# EAGLE design lcd_backpack_v2 (EAGLE 5.10)
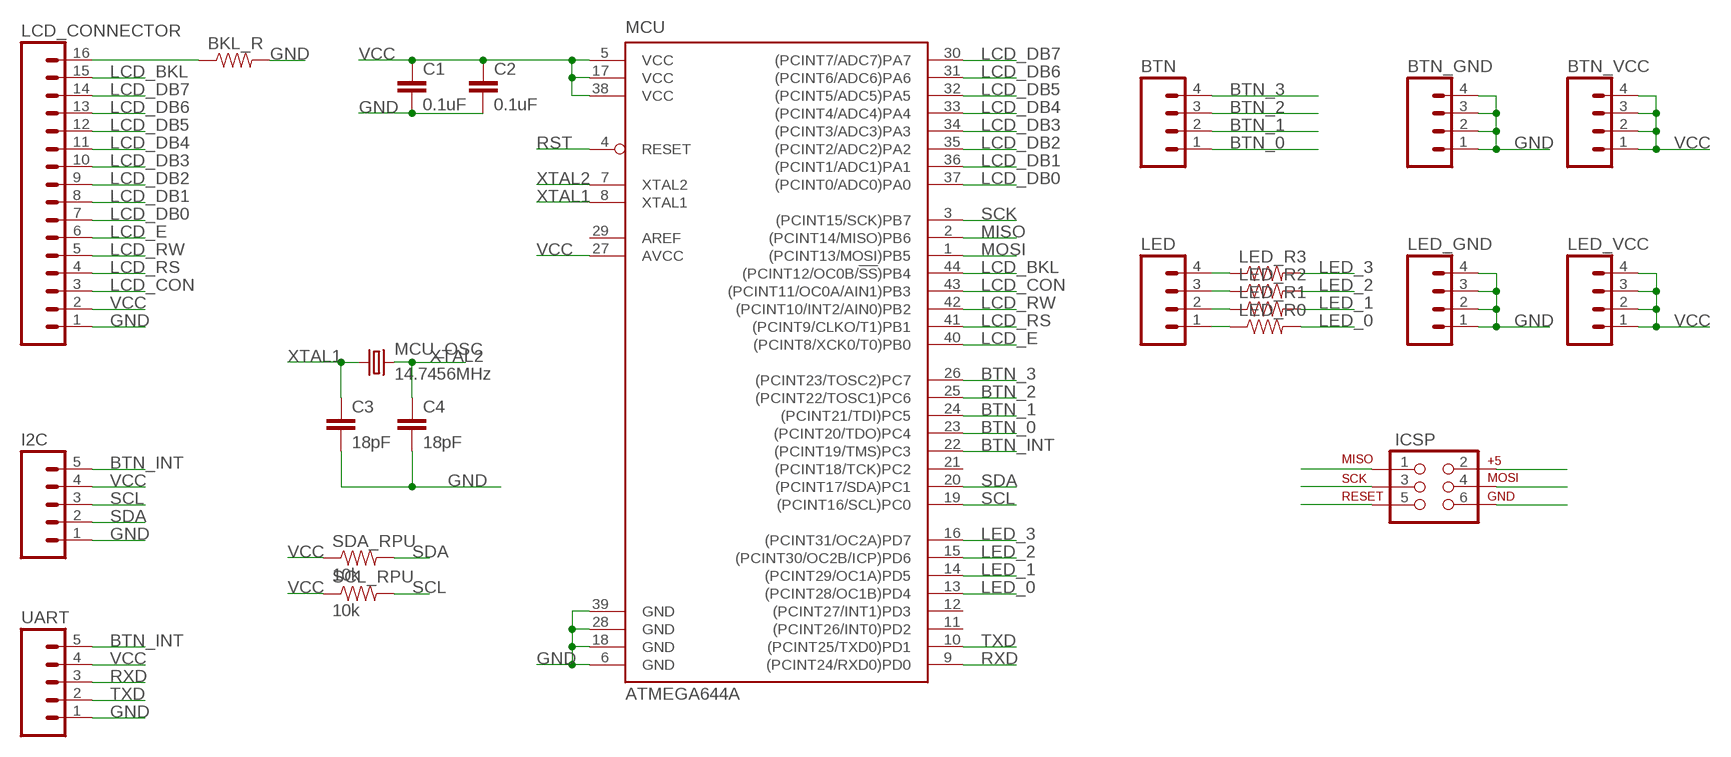
[diagram p0: schematic, sheet 1]

## Parts
BKL_R  RESISTOR0603-RES  [0603-RES]
BTN  M04PTH  [1X04]
BTN_GND  M04PTH  [1X04]
BTN_VCC  M04PTH  [1X04]
C1  0.1uF  CAP0603-CAP  [0603-CAP]
C2  0.1uF  CAP0603-CAP  [0603-CAP]
C3  18pF  CAP0603-CAP  [0603-CAP]
C4  18pF  CAP0603-CAP  [0603-CAP]
I2C  M05PTH  [1X05]
ICSP  AVR_SPI_PRG_6PTH  [2X3]
LCD_CONNECTOR  M16LONGPADS  [1X16_LONGPADS]
LED  M04PTH  [1X04]
LED_GND  M04PTH  [1X04]
LED_R0  RESISTOR0603-RES  [0603-RES]
LED_R1  RESISTOR0603-RES  [0603-RES]
LED_R2  RESISTOR0603-RES  [0603-RES]
LED_R3  RESISTOR0603-RES  [0603-RES]
LED_VCC  M04PTH  [1X04]
MCU  ATMEGA644A  [TQFP44]
MCU_OSC  14.7456MHz  CRYSTAL5X3  [CRYSTAL-SMD-5X3]
SCL_RPU  10k  RESISTOR0603-RES  [0603-RES]
SDA_RPU  10k  RESISTOR0603-RES  [0603-RES]
UART  M05PTH  [1X05]

## Nets
BTN_0: BTN.1 MCU.23((PCINT20/TDO)PC4)
BTN_1: BTN.2 MCU.24((PCINT21/TDI)PC5)
BTN_2: BTN.3 MCU.25((PCINT22/TOSC1)PC6)
BTN_3: BTN.4 MCU.26((PCINT23/TOSC2)PC7)
BTN_INT: I2C.5 MCU.22((PCINT19/TMS)PC3) UART.5
GND [supply]: BKL_R.2 BTN_GND.1 BTN_GND.2 BTN_GND.3 BTN_GND.4 C1.2 C2.2 C3.2 C4.2 I2C.1 ICSP.6 LCD_CONNECTOR.1 LED_GND.1 LED_GND.2 LED_GND.3 LED_GND.4 MCU.6(GND) MCU.18(GND) MCU.28(GND) MCU.39(GND) UART.1
LCD_BKL: LCD_CONNECTOR.15 MCU.44((PCINT12/OC0B/!SS!)PB4)
LCD_CON: LCD_CONNECTOR.3 MCU.43((PCINT11/OC0A/AIN1)PB3)
LCD_DB0: LCD_CONNECTOR.7 MCU.37((PCINT0/ADC0)PA0)
LCD_DB1: LCD_CONNECTOR.8 MCU.36((PCINT1/ADC1)PA1)
LCD_DB2: LCD_CONNECTOR.9 MCU.35((PCINT2/ADC2)PA2)
LCD_DB3: LCD_CONNECTOR.10 MCU.34((PCINT3/ADC3)PA3)
LCD_DB4: LCD_CONNECTOR.11 MCU.33((PCINT4/ADC4)PA4)
LCD_DB5: LCD_CONNECTOR.12 MCU.32((PCINT5/ADC5)PA5)
LCD_DB6: LCD_CONNECTOR.13 MCU.31((PCINT6/ADC6)PA6)
LCD_DB7: LCD_CONNECTOR.14 MCU.30((PCINT7/ADC7)PA7)
LCD_E: LCD_CONNECTOR.6 MCU.40((PCINT8/XCK0/T0)PB0)
LCD_RS: LCD_CONNECTOR.4 MCU.41((PCINT9/CLKO/T1)PB1)
LCD_RW: LCD_CONNECTOR.5 MCU.42((PCINT10/INT2/AIN0)PB2)
LED_0: LED_R0.2 MCU.13((PCINT28/OC1B)PD4)
LED_1: LED_R1.2 MCU.14((PCINT29/OC1A)PD5)
LED_2: LED_R2.2 MCU.15((PCINT30/OC2B/ICP)PD6)
LED_3: LED_R3.2 MCU.16((PCINT31/OC2A)PD7)
MISO: ICSP.1 MCU.2((PCINT14/MISO)PB6)
MOSI: ICSP.4 MCU.1((PCINT13/MOSI)PB5)
N$1: LED.1 LED_R0.1
N$2: LED.2 LED_R1.1
N$3: LED.3 LED_R2.1
N$4: LED.4 LED_R3.1
N$9: BKL_R.1 LCD_CONNECTOR.16
RST: ICSP.5 MCU.4(RESET)
RXD: MCU.9((PCINT24/RXD0)PD0) UART.3
SCK: ICSP.3 MCU.3((PCINT15/SCK)PB7)
SCL: I2C.3 MCU.19((PCINT16/SCL)PC0) SCL_RPU.2
SDA: I2C.2 MCU.20((PCINT17/SDA)PC1) SDA_RPU.2
TXD: MCU.10((PCINT25/TXD0)PD1) UART.2
VCC [supply]: BTN_VCC.1 BTN_VCC.2 BTN_VCC.3 BTN_VCC.4 C1.1 C2.1 I2C.4 ICSP.2 LCD_CONNECTOR.2 LED_VCC.1 LED_VCC.2 LED_VCC.3 LED_VCC.4 MCU.5(VCC) MCU.17(VCC) MCU.27(AVCC) MCU.38(VCC) SCL_RPU.1 SDA_RPU.1 UART.4
XTAL1: C3.1 MCU.8(XTAL1) MCU_OSC.1
XTAL2: C4.1 MCU.7(XTAL2) MCU_OSC.3
Unconnected: MCU.11((PCINT26/INT0)PD2) MCU.12((PCINT27/INT1)PD3) MCU.21((PCINT18/TCK)PC2) MCU.29(AREF)

## Library data of the parts
BKL_R LED_R0 LED_R1-LED_R3 SCL_RPU SDA_RPU = SparkFun:RESISTOR: Resistor Basic schematic elements and footprints for 0603, 1206, and PTH 1/10th watt (small) resistors.
BTN BTN_GND BTN_VCC LED LED_GND LED_VCC = SparkFun:M04: Header 4 Standard 4-pin 0.1" header. Use with straight break away headers (SKU : PRT-00116), right angle break away headers (PRT-00553), swiss pins (PRT-00743), machine pins (PRT-00117), and female headers (PRT-00115). Molex polarized connector foot print use with SKU : PRT-08231 with associated crimp pins and housings.
C1-C4 = SparkFun:CAP: Capacitor Standard 0603 ceramic capacitor, and 0.1" leaded capacitor.
I2C UART = SparkFun:M05: Header 5 Standard 5-pin 0.1" header. Use with straight break away headers (SKU : PRT-00116), right angle break away headers (PRT-00553), swiss pins (PRT-00743), machine pins (PRT-00117), and female headers (PRT-00115). Molex polarized connector foot print use with SKU : PRT-08230 with associated crimp pins and housings.
ICSP = SparkFun:AVR_SPI_PRG_6: AVR ISP 6 Pin This is the reduced ISP connector for AVR programming. Common on Arduino. This footprint will take up less PCB space and can be used with a 10-pin to 6-pin adapter such as SKU: BOB-08508
LCD_CONNECTOR = SparkFun:M16
MCU = atmel:ATMEGA644: 8-bit Microcontroller with 64K Bytes In-System Programmable Flash Source: http://www.atmel.com/dyn/resources/prod_documents/doc2593.pdf
MCU_OSC = SparkFun:CRYSTAL: Crystals Various standard crystals. Proven footprints. Spark Fun Electronics SKU : COM-00534

## Net classes
0 signal: width 0.152 mm
1 supply: width 0.305 mm

## Board
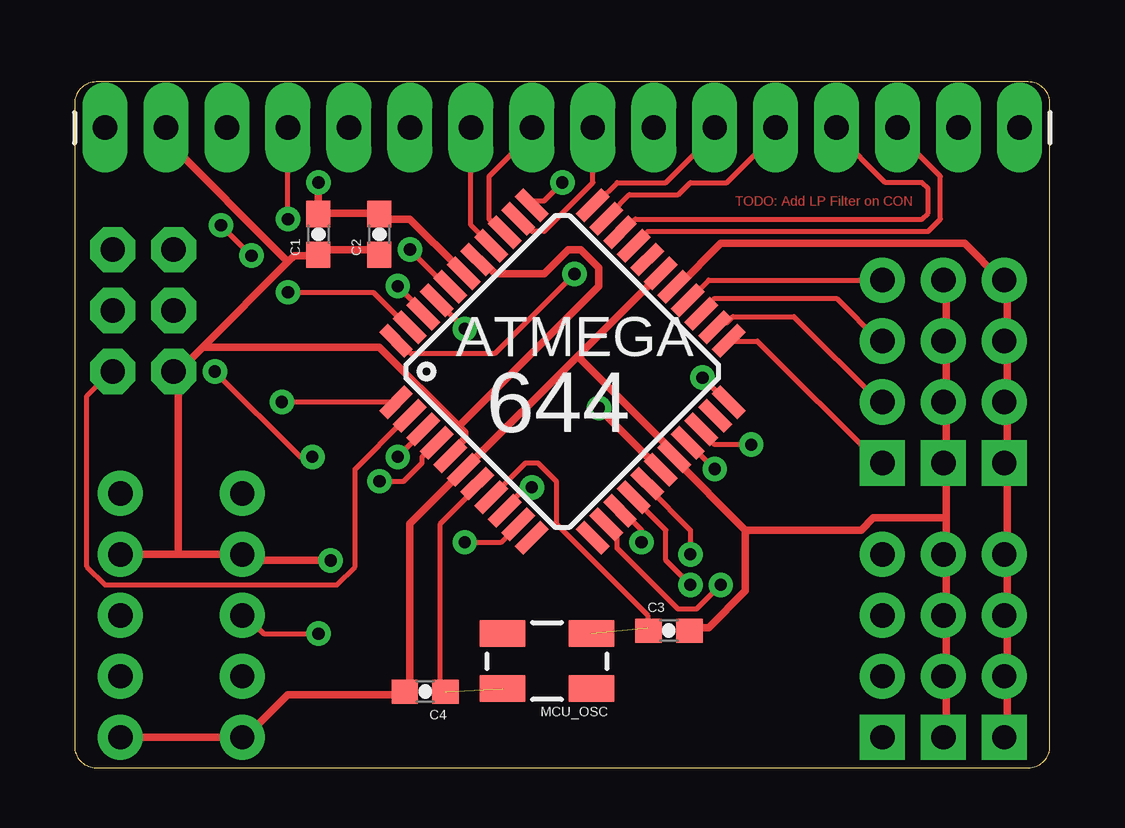
[diagram p1: board, top side]
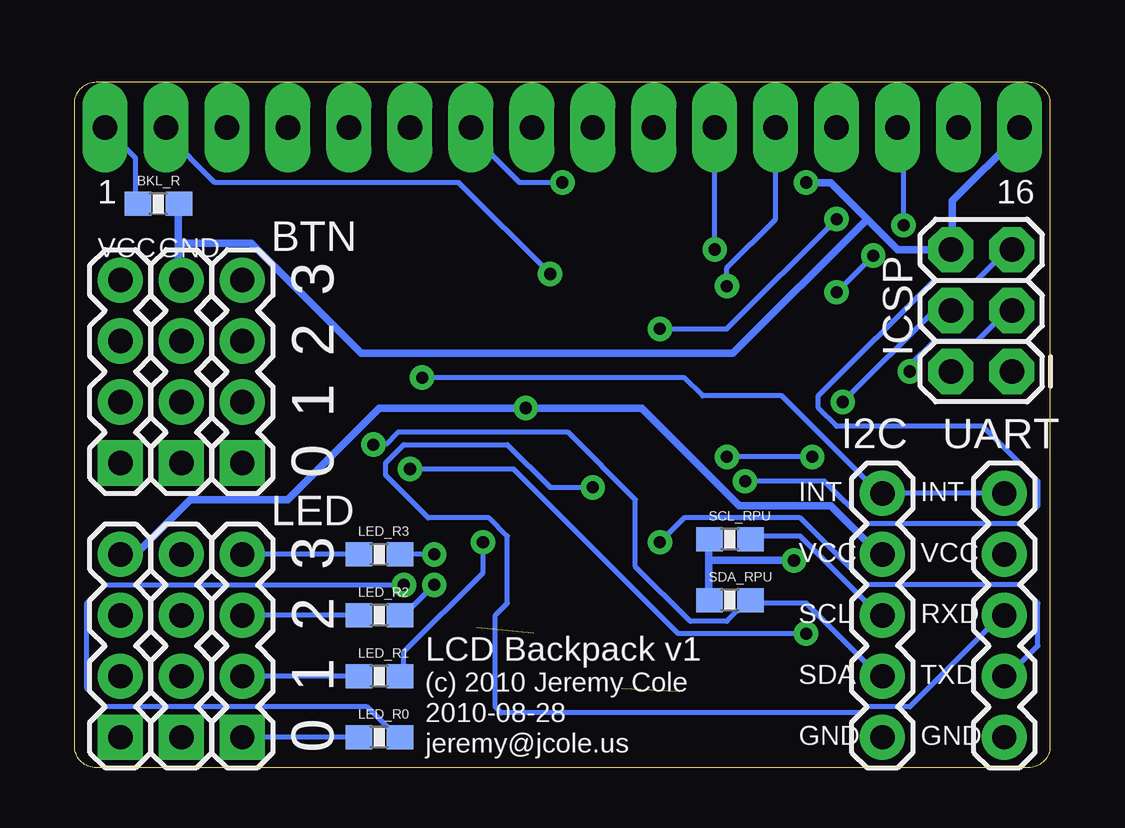
[diagram p2: board, bottom side, seen from below]

Size 40.64 x 28.57 mm. Coordinates in mm from the lower left corner, seen from the top.
Outline: 39.74,0 arc90 40.64,0.9 40.64,27.68 arc90 39.74,28.57 0.9,28.57 arc90 0,27.68 0,0.9 arc90 0.9,0 39.74,0
Copper layers (1*16): Top 0.035mm / dielectric 1.5mm / Bottom 0.035mm
Design rules "SparkFun": minimum track width 8mil, minimum drill 20mil, track to track 8mil, track to pad 8mil, pad to pad 8mil, via to via 8mil, smd to smd 8mil, copper to edge 10mil, drill to drill 8mil, minimum pad ring 12mil, minimum via ring 10mil, stop-mask expansion 4mil, vias tented up to drill 25mil, thermal gap 10mil
tRestrict: area 16.5,2.5 to 22.9,6.3
bRestrict: area 16.5,2.5 to 22.9,6.3

### Footprints (pad centres in the part's own frame; a part is rotated, then mirrored left to right if it is on the bottom)
0603-RES = smd 1.1 x 1: 1 -0.85,0; 2 0.85,0
1X04 = drill 1.016 pad 1.88 square: 1 0,0 | drill 1.016 pad 1.88 round: 2 2.54,0; 3 5.08,0; 4 7.62,0
0603-CAP = smd 1.1 x 1: 1 -0.85,0; 2 0.85,0
1X05 = drill 1.016 pad 1.88 round: 1 0,0; 2 2.54,0; 3 5.08,0; 4 7.62,0; 5 10.16,0
2X3 = drill 1.016 pad 1.88 octagon: 1 0,0; 2 0,2.54; 3 2.54,0; 4 2.54,2.54; 5 5.08,0; 6 5.08,2.54
1X16_LONGPADS = drill 1.016 pad 1.88 long: 1 0,0; 2 2.54,0; 3 5.08,0; 4 7.62,0; 5 10.16,0; 6 12.7,0; 7 15.24,0; 8 17.78,0; 9 20.32,0; 10 22.86,0; 11 25.4,0; 12 27.94,0; 13 30.48,0; 14 33.02,0; 15 35.56,0; 16 38.1,0
TQFP44 = smd 1.5 x 0.5: 1 -5.8,4; 2 -5.8,3.2; 3 -5.8,2.4; 4 -5.8,1.6; 5 -5.8,0.8; 6 -5.8,0; 7 -5.8,-0.8; 8 -5.8,-1.6; 9 -5.8,-2.4; 10 -5.8,-3.2; 11 -5.8,-4; 23 5.8,-4; 24 5.8,-3.2; 25 5.8,-2.4; 26 5.8,-1.6; 27 5.8,-0.8; 28 5.8,0; 29 5.8,0.8; 30 5.8,1.6; 31 5.8,2.4; 32 5.8,3.2; 33 5.8,4 | smd 0.5 x 1.5: 12 -4,-5.8; 13 -3.2,-5.8; 14 -2.4,-5.8; 15 -1.6,-5.8; 16 -0.8,-5.8; 17 0,-5.8; 18 0.8,-5.8; 19 1.6,-5.8; 20 2.4,-5.8; 21 3.2,-5.8; 22 4,-5.8; 34 4,5.8; 35 3.2,5.8; 36 2.4,5.8; 37 1.6,5.8; 38 0.8,5.8; 39 0,5.8; 40 -0.8,5.8; 41 -1.6,5.8; 42 -2.4,5.8; 43 -3.2,5.8; 44 -4,5.8
CRYSTAL-SMD-5X3 = smd 1.9 x 1.1: 1 -1.85,-1.15; 2 1.85,-1.15; 3 1.85,1.15; 4 -1.85,1.15

### Placement (x,y rotation side)
BKL_R  37.15,23.5 0 bottom
BTN  33.66,12.7 90 bottom
BTN_GND  36.2,12.7 90 bottom
BTN_VCC  38.73,12.7 90 bottom
C1  10.16,22.23 90 top
C2  12.7,22.23 90 top
C3  24.77,5.71 0 top
C4  14.61,3.17 180 top
I2C  6.99,1.27 90 bottom
ICSP  1.59,16.51 90 bottom
LCD_CONNECTOR  1.27,26.67 0 top
LED  33.66,1.27 90 bottom
LED_GND  36.2,1.27 90 bottom
LED_R0  27.94,1.27 0 bottom
LED_R1  27.94,3.81 0 bottom
LED_R2  27.94,6.35 0 bottom
LED_R3  27.94,8.89 0 bottom
LED_VCC  38.73,1.27 90 bottom
MCU  20.32,16.51 45 top
MCU_OSC  19.68,4.45 180 top
SCL_RPU  13.34,9.53 0 bottom
SDA_RPU  13.34,6.99 0 bottom
UART  1.91,1.27 90 bottom

### Tracks (layer width: path | path; a pad name or v marks a point on that pad's centre or on a via)
BTN_0
  Top 0.203: MCU.23 27.43,17.78 28.45,17.78 33.53,12.7 BTN.1
BTN_1
  Top 0.203: MCU.24 26.92,18.54 27.18,18.54 27.43,18.8 29.97,18.8 33.53,15.24 BTN.2
BTN_2
  Top 0.203: MCU.25 26.16,19.05 26.67,19.56 31.75,19.56 33.53,17.78 BTN.3
BTN_3
  Top 0.203: MCU.26 25.65,19.56 26.42,20.32 BTN.4
BTN_INT  (via drill 0.51)
  Top 0.203: v26.16,16.26 27.18,15.24 MCU.22
  Bottom 0.203: v26.16,16.26 15.24,16.26 14.48,15.49 11.18,15.49 7.11,11.43 I2C.5 UART.5
GND  (via drill 0.51)
  Top 0.305: UART.1 I2C.1 7.11,1.27 8.89,3.05 13.72,3.05 C4.2 13.97,3.3 13.97,10.16 MCU.6 21.08,17.27 | 27.94,9.91 27.94,7.37 26.42,5.84 25.65,5.84 C3.2 | 27.94,9.91 24.89,12.95 MCU.18 24.89,13.21 21.08,17.02 21.08,17.27 | 21.08,17.27 MCU.28 | 10.16,23.11 12.7,23.11 C2.2 12.7,22.86 13.97,22.86 16,20.83 MCU.39 | v10.16,24.38 10.16,23.11 | 10.16,23.11 C1.2 | 36.32,3.81 36.32,1.27 LED_GND.1 | 36.32,8.89 36.32,6.35 | 36.32,6.35 36.32,3.81 | 36.32,3.81 LED_GND.2 | 36.32,6.35 LED_GND.3 | 36.32,12.7 36.32,15.24 | 36.32,17.78 36.32,20.32 BTN_GND.4 | 36.32,15.24 36.32,17.78 | 36.32,15.24 BTN_GND.2 | 36.32,17.78 BTN_GND.3 | 36.32,10.41 36.32,12.7 | 36.32,10.41 36.32,8.89 | 36.32,8.89 LED_GND.4 | 36.32,12.7 BTN_GND.1 | 27.94,9.91 32.77,9.91 33.27,10.41 36.32,10.41
  Bottom 0.305: LCD_CONNECTOR.1 1.27,26.42 4.06,23.62 4.06,21.59 ICSP.6 6.35,21.59 7.62,22.86 | v10.16,24.38 9.14,24.38 7.62,22.86 | 36.32,21.84 36.32,20.32 BTN_GND.4 | 36.32,21.84 36.32,23.37 BKL_R.2 | 7.62,22.86 13.21,17.27 28.7,17.27 33.27,21.84 36.32,21.84
LCD_BKL  (via drill 0.51)
  Top 0.203: v20.83,20.57 17.53,17.27 13.97,17.27 13.46,17.78 MCU.44
  Bottom 0.203: v20.83,20.57 24.64,24.38 34.8,24.38 36.83,26.42 LCD_CONNECTOR.15
LCD_CON  (via drill 0.51)
  Top 0.203: v8.89,19.81 12.45,19.81 13.72,18.54 MCU.43 | v6.1,22.61 v7.37,21.34
  Bottom 0.203: v7.37,21.34 v8.89,19.81 | v6.1,22.61 6.1,26.42 LCD_CONNECTOR.3
LCD_DB0
  Top 0.203: LCD_CONNECTOR.7 16.51,22.61 17.27,21.84 MCU.37
LCD_DB1
  Top 0.203: LCD_CONNECTOR.8 19.05,26.42 17.27,24.64 17.27,22.86 17.78,22.35 MCU.36
LCD_DB2
  Top 0.203: LCD_CONNECTOR.9 21.59,24.38 19.56,22.35 19.05,22.35 18.54,22.86 MCU.35
LCD_DB3  (via drill 0.51)
  Top 0.203: v20.32,24.38 19.56,23.62 19.05,23.62 MCU.34
  Bottom 0.203: v20.32,24.38 22.1,24.38 24.13,26.42 LCD_CONNECTOR.10
LCD_DB4
  Top 0.203: LCD_CONNECTOR.11 26.67,26.42 24.64,24.38 22.61,24.38 21.84,23.62 MCU.33
LCD_DB5
  Top 0.203: LCD_CONNECTOR.12 29.21,26.42 27.18,24.38 25.65,24.38 25.15,23.88 23.11,23.88 22.35,23.11 MCU.32
LCD_DB6
  Top 0.203: LCD_CONNECTOR.13 31.75,26.42 33.78,24.38 35.31,24.38 35.56,24.13 35.56,23.11 35.31,22.86 23.37,22.86 22.86,22.35 MCU.31
LCD_DB7
  Top 0.203: LCD_CONNECTOR.14 34.29,26.42 36.07,24.64 36.07,22.86 35.56,22.35 23.88,22.35 23.37,21.84 MCU.30
LCD_E  (via drill 0.51)
  Top 0.203: v13.97,21.59 15.49,20.07 MCU.40
  Bottom 0.203: v13.97,21.59 LCD_CONNECTOR.6
LCD_RS  (via drill 0.51)
  Top 0.203: v16.26,18.29 15.24,19.3 MCU.41 | v8.89,22.86 LCD_CONNECTOR.4
  Bottom 0.203: v16.26,18.29 13.46,18.29 v8.89,22.86
LCD_RW  (via drill 0.51)
  Top 0.203: v13.46,20.07 14.48,19.05 MCU.42
  Bottom 0.203: v13.46,20.07 13.46,20.83 11.43,22.86 LCD_CONNECTOR.5
LED_0  (via drill 0.51)
  Top 0.203: v26.92,7.62 25.91,6.6 25.15,6.6 22.61,9.14 22.61,9.65 22.35,9.91 MCU.13
  Bottom 0.203: v26.92,7.62 39.37,7.62 40.13,6.86 40.13,3.3 39.37,2.54 28.45,2.54 27.18,1.27 LED_R0.2
LED_1  (via drill 0.51)
  Top 0.203: v23.62,9.4 23.62,9.91 22.86,10.67 MCU.14
  Bottom 0.203: v23.62,9.4 23.62,8.13 26.92,4.83 26.92,3.81 LED_R1.2
LED_2  (via drill 0.51)
  Top 0.203: v25.65,7.62 24.64,8.64 24.64,9.91 23.37,11.18 MCU.15
  Bottom 0.203: v25.65,7.62 26.92,6.35 LED_R2.2
LED_3  (via drill 0.51)
  Top 0.203: v25.65,8.89 25.65,9.91 23.88,11.68 MCU.16
  Bottom 0.203: v25.65,8.89 LED_R3.2
MISO
  Top 0.203: MCU.2 13.72,14.48 11.68,12.45 11.68,8.38 10.92,7.62 1.27,7.62 0.51,8.38 0.51,15.49 1.52,16.51 ICSP.1
MOSI  (via drill 0.51)
  Top 0.203: v8.64,15.24 13.21,15.24 MCU.1
  Bottom 0.203: v8.64,15.24 4.83,19.05 ICSP.4
N$1
  Bottom 0.203: LED_R0.1 LED.1
N$2
  Bottom 0.203: LED_R1.1 LED.2
N$3
  Bottom 0.203: LED_R2.1 LED.3
N$4
  Bottom 0.203: LED_R3.1 LED.4
N$9
  Bottom 0.203: LCD_CONNECTOR.16 38.1,25.4 38.1,23.62 BKL_R.1
RST  (via drill 0.51)
  Top 0.203: v12.7,11.94 13.72,11.94 14.48,12.7 14.48,12.95 14.99,13.46 MCU.4
  Bottom 0.203: v12.7,11.94 9.4,11.94 7.62,10.16 1.27,10.16 0.51,10.92 0.51,11.94 2.79,14.22 8.89,14.22 9.65,14.99 9.65,15.49 4.83,20.32 3.05,20.32 1.78,21.59 ICSP.5
RXD  (via drill 0.51)
  Top 0.203: v19.05,11.68 18.8,11.68 18.03,10.92 MCU.9
  Bottom 0.203: v19.05,11.68 20.83,11.68 22.61,13.46 26.92,13.46 27.69,12.7 27.69,12.19 25.91,10.41 23.37,10.41 22.61,9.65 22.61,6.86 23.11,6.35 23.11,2.54 22.86,2.29 7.87,2.29 7.62,2.54 5.84,2.54 2.03,6.35 UART.3
SCK  (via drill 0.51)
  Top 0.203: v13.46,12.95 14.48,13.97 MCU.3 | v9.91,12.95 9.4,12.95 v5.84,16.51
  Bottom 0.203: v9.91,12.95 v13.46,12.95 | v5.84,16.51 5.84,16.76 4.83,17.78 3.05,17.78 1.78,19.05 ICSP.3
SCL  (via drill 0.51)
  Top 0.203: v26.67,12.45 25.65,13.46 MCU.19 | v10.16,5.59 7.87,5.59 7.11,6.35 I2C.3
  Bottom 0.203: SCL_RPU.2 12.45,9.65 10.41,9.65 7.11,6.35 I2C.3 | v26.67,12.45 22.35,12.45 15.49,5.59 v10.16,5.59
SDA  (via drill 0.51)
  Top 0.203: v28.19,13.46 26.67,13.46 26.16,13.97 MCU.20
  Bottom 0.203: I2C.2 7.11,3.81 10.16,6.86 12.45,6.86 SDA_RPU.2 12.7,6.86 13.46,6.1 14.99,6.1 17.27,8.38 17.27,11.18 20.07,13.97 27.18,13.97 27.69,13.46 v28.19,13.46
TXD  (via drill 0.51)
  Top 0.203: v16.26,9.4 17.78,9.4 18.29,9.91 MCU.10
  Bottom 0.203: v16.26,9.4 15.24,10.41 10.41,10.41 7.62,7.62 1.27,7.62 0.51,6.86 0.51,5.08 1.78,3.81 UART.2
VCC  (via drill 0.51)
  Top 0.305: 38.86,3.81 38.86,1.27 LED_VCC.1 | 38.86,8.89 38.86,6.35 | 38.86,6.35 38.86,3.81 | 38.86,3.81 LED_VCC.2 | 38.86,6.35 LED_VCC.3 | 38.86,12.7 38.86,15.24 | MCU.27 25.15,20.07 26.92,21.84 37.08,21.84 38.61,20.32 BTN_VCC.4 38.86,20.32 38.86,17.78 | 38.86,15.24 38.86,17.78 | 38.86,15.24 BTN_VCC.2 | 38.86,17.78 BTN_VCC.3 | 38.86,8.89 38.86,12.7 | LED_VCC.4 38.86,8.89 | 38.86,12.7 BTN_VCC.1 | v21.84,14.99 24.38,12.45 MCU.17 | v10.67,8.64 7.37,8.64 7.11,8.89 I2C.4 4.32,8.89 | UART.4 4.32,8.89 | C2.1 12.7,21.59 10.16,21.59 C1.1 10.16,21.34 9.14,21.34 8.89,21.08 | 16,14.22 12.7,17.53 5.33,17.53 | 16,14.22 16.26,13.97 16.26,13.72 15.75,13.21 MCU.5 | 4.32,16.51 5.33,17.53 | 16,14.22 21.84,20.07 21.84,20.83 21.08,21.59 20.57,21.59 19.56,20.57 17.53,20.57 17.02,21.08 MCU.38 | 5.33,17.53 8.89,21.08 | LCD_CONNECTOR.2 3.81,26.16 8.89,21.08 | 4.32,8.89 4.32,16.51 | 4.32,16.51 ICSP.2
  Bottom 0.305: 14.22,8.64 14.22,9.4 SCL_RPU.1 | 14.22,8.64 14.22,7.11 SDA_RPU.1 | I2C.4 7.11,8.89 9.14,10.92 12.95,10.92 17.02,14.99 v21.84,14.99 27.94,14.99 31.75,11.18 35.81,11.18 38.1,8.89 LED_VCC.4 | v10.67,8.64 14.22,8.64
XTAL1  (1 unrouted)
  Top 0.203: C3.1 23.88,5.84 23.88,6.35 20.07,10.16 20.07,11.94 19.3,12.7 18.8,12.7 17.53,11.43 MCU.8
XTAL2  (1 unrouted)
  Top 0.203: C4.1 15.24,3.3 15.24,10.16 16.76,11.68 MCU.7

### Text on the board
Top: TODO: Add LP Filter on CON
tNames: ATMEGA | 644
bNames: 16 | 1 | GND | VCC | 3 | 2 | 1 | 0 | INT | INT | VCC | VCC | 3 | RXD | SCL | 2 | LCD Backpack v1 | TXD | SDA | (c) 2010 Jeremy Cole | 1 | 2010-08-28 | GND | GND | jeremy@jcole.us | 0